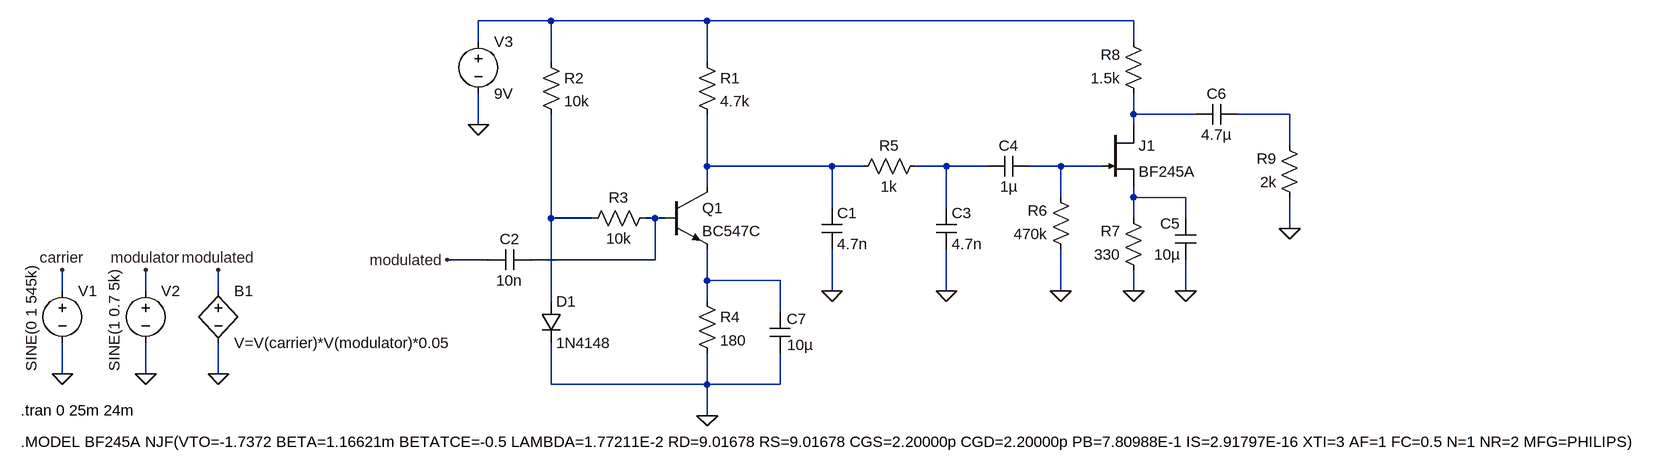
[diagram p0: schematic audion-receiver.asc]
audion-receiver.asc, the LTspice schematic file:
Version 4
SHEET 1 1944 680
WIRE 16 -128 -96 -128
WIRE 256 -128 16 -128
WIRE 912 -128 256 -128
WIRE -96 -96 -96 -128
WIRE 912 -96 912 -128
WIRE 16 -64 16 -128
WIRE 256 -64 256 -128
WIRE 912 16 912 -16
WIRE 1008 16 912 16
WIRE 1152 16 1072 16
WIRE -96 32 -96 -16
WIRE 912 32 912 16
WIRE 1152 64 1152 16
WIRE 256 96 256 16
WIRE 448 96 256 96
WIRE 496 96 448 96
WIRE 624 96 576 96
WIRE 688 96 624 96
WIRE 800 96 752 96
WIRE 864 96 800 96
WIRE 256 128 256 96
WIRE 800 144 800 96
WIRE 912 144 912 128
WIRE 992 144 912 144
WIRE 448 160 448 96
WIRE 624 160 624 96
WIRE 16 176 16 16
WIRE 80 176 16 176
WIRE 176 176 160 176
WIRE 192 176 176 176
WIRE 912 176 912 144
WIRE 992 176 992 144
WIRE 1152 192 1152 144
WIRE -80 240 -144 240
WIRE 176 240 176 176
WIRE 176 240 -16 240
WIRE 256 272 256 224
WIRE 368 272 256 272
WIRE -736 288 -736 256
WIRE -608 288 -608 256
WIRE -496 288 -496 256
WIRE 448 288 448 224
WIRE 624 288 624 224
WIRE 800 288 800 224
WIRE 912 288 912 256
WIRE 992 288 992 240
WIRE 16 304 16 176
WIRE 256 304 256 272
WIRE 368 320 368 272
WIRE -736 416 -736 368
WIRE -608 416 -608 368
WIRE -496 416 -496 368
WIRE 16 432 16 368
WIRE 256 432 256 384
WIRE 256 432 16 432
WIRE 368 432 368 384
WIRE 368 432 256 432
WIRE 256 480 256 432
FLAG 256 480 0
FLAG -144 240 modulated
FLAG -736 256 carrier
FLAG -608 256 modulator
FLAG -736 416 0
FLAG -608 416 0
FLAG -496 416 0
FLAG -496 256 modulated
FLAG -96 32 0
FLAG 448 288 0
FLAG 624 288 0
FLAG 800 288 0
FLAG 912 288 0
FLAG 992 288 0
FLAG 1152 192 0
SYMBOL npn 192 128 R0
SYMATTR InstName Q1
SYMATTR Value BC547C
SYMBOL res 240 -80 R0
SYMATTR InstName R1
SYMATTR Value 4.7k
SYMBOL res 0 -80 R0
SYMATTR InstName R2
SYMATTR Value 10k
SYMBOL res 176 160 R90
WINDOW 0 0 56 VBottom 2
WINDOW 3 32 56 VTop 2
SYMATTR InstName R3
SYMATTR Value 10k
SYMBOL diode 0 304 R0
SYMATTR InstName D1
SYMATTR Value 1N4148
SYMBOL res 240 288 R0
SYMATTR InstName R4
SYMATTR Value 180
SYMBOL voltage -736 272 R0
WINDOW 3 -48 -25 VRight 2
WINDOW 123 0 0 Left 0
WINDOW 39 0 0 Left 0
SYMATTR Value SINE(0 1 545k)
SYMATTR InstName V1
SYMBOL voltage -608 272 R0
WINDOW 3 -48 -18 VRight 2
WINDOW 123 0 0 Left 0
WINDOW 39 0 0 Left 0
SYMATTR Value SINE(1 0.7 5k)
SYMATTR InstName V2
SYMBOL bv -496 272 R0
SYMATTR InstName B1
SYMATTR Value V=V(carrier)*V(modulator)*0.05
SYMBOL voltage -96 -112 R0
WINDOW 123 0 0 Left 0
WINDOW 39 0 0 Left 0
SYMATTR InstName V3
SYMATTR Value 9V
SYMBOL cap 432 160 R0
SYMATTR InstName C1
SYMATTR Value 4.7n
SYMBOL cap -16 224 R90
WINDOW 0 0 32 VBottom 2
WINDOW 3 32 32 VTop 2
SYMATTR InstName C2
SYMATTR Value 10n
SYMBOL cap 608 160 R0
SYMATTR InstName C3
SYMATTR Value 4.7n
SYMBOL res 592 80 R90
WINDOW 0 0 56 VBottom 2
WINDOW 3 32 56 VTop 2
SYMATTR InstName R5
SYMATTR Value 1k
SYMBOL cap 752 80 R90
WINDOW 0 0 32 VBottom 2
WINDOW 3 32 32 VTop 2
SYMATTR InstName C4
SYMATTR Value 1µ
SYMBOL njf 864 32 R0
SYMATTR InstName J1
SYMATTR Value BF245A
SYMBOL res 816 240 R180
WINDOW 0 36 76 Left 2
WINDOW 3 36 40 Left 2
SYMATTR InstName R6
SYMATTR Value 470k
SYMBOL res 928 272 R180
WINDOW 0 36 76 Left 2
WINDOW 3 36 40 Left 2
SYMATTR InstName R7
SYMATTR Value 330
SYMBOL res 928 0 R180
WINDOW 0 36 76 Left 2
WINDOW 3 36 40 Left 2
SYMATTR InstName R8
SYMATTR Value 1.5k
SYMBOL cap 1008 240 R180
WINDOW 0 24 56 Left 2
WINDOW 3 24 8 Left 2
SYMATTR InstName C5
SYMATTR Value 10µ
SYMBOL cap 1072 0 R90
WINDOW 0 0 32 VBottom 2
WINDOW 3 32 32 VTop 2
SYMATTR InstName C6
SYMATTR Value 4.7µ
SYMBOL res 1168 160 R180
WINDOW 0 36 76 Left 2
WINDOW 3 36 40 Left 2
SYMATTR InstName R9
SYMATTR Value 2k
SYMBOL cap 384 384 R180
WINDOW 0 -25 53 Left 2
WINDOW 3 -36 13 Left 2
SYMATTR InstName C7
SYMATTR Value 10µ
TEXT -800 472 Left 2 !.tran 0 25m 24m
TEXT -800 520 Left 2 !.MODEL BF245A NJF(VTO=-1.7372 BETA=1.16621m BETATCE=-0.5 LAMBDA=1.77211E-2 RD=9.01678 RS=9.01678 CGS=2.20000p CGD=2.20000p PB=7.80988E-1 IS=2.91797E-16 XTI=3 AF=1 FC=0.5 N=1 NR=2 MFG=PHILIPS)

The netlist it stands for:
* audion-receiver.asc
Q1 N004 N009 N010 0 BC547C
R1 N001 N004 4.7k
R2 N001 N008 10k
R3 N009 N008 10k
D1 N008 0 1N4148
R4 N010 0 180
V1 carrier 0 SINE(0 1 545k)
V2 modulator 0 SINE(1 0.7 5k)
B1 modulated 0 V=V(carrier)*V(modulator)*0.05
V3 N001 0 9V
C1 N004 0 4.7n
C2 N009 modulated 10n
C3 N005 0 4.7n
R5 N005 N004 1k
C4 N006 N005 1µ
J1 N002 N006 N007 BF245A
R6 0 N006 470k
R7 0 N007 330
R8 N002 N001 1.5k
C5 0 N007 10µ
C6 N003 N002 4.7µ
R9 0 N003 2k
C7 0 N010 10µ
.model D D
.lib standard.dio
.model NPN NPN
.model PNP PNP
.lib standard.bjt
.model NJF NJF
.model PJF PJF
.lib standard.jft
.tran 0 25m 24m
.MODEL BF245A NJF(VTO=-1.7372 BETA=1.16621m BETATCE=-0.5 LAMBDA=1.77211E-2 RD=9.01678 RS=9.01678 CGS=2.20000p CGD=2.20000p PB=7.80988E-1 IS=2.91797E-16 XTI=3 AF=1 FC=0.5 N=1 NR=2 MFG=PHILIPS)
.backanno
.end